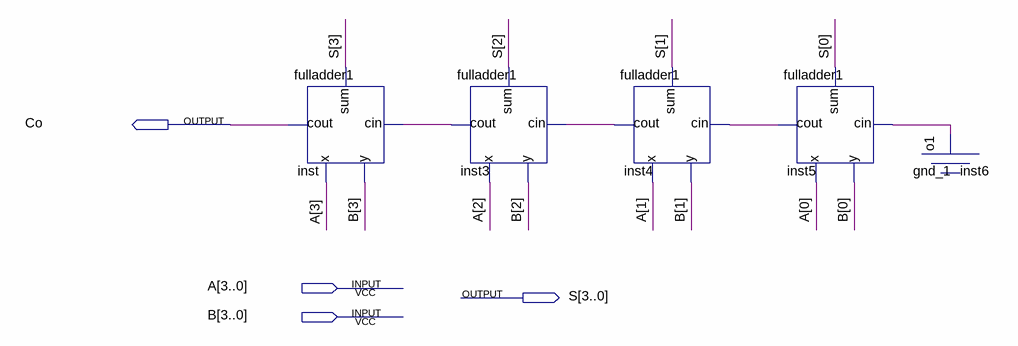
[diagram p0: schematic sheet]
// Quartus schematic FA4.bdf as structural Verilog: 5 symbols, 4 pins
module FA4 (
  input  [3:0] A,
  input  [3:0] B,
  output Co,
  output [3:0] S
);

  wire inst3_cout, inst4_cout, inst5_cout, inst6_o1;

  fulladder1 inst (.x(A[3]), .y(B[3]), .cin(inst3_cout), .sum(S[3]), .cout(Co));
  fulladder1 inst3 (.x(A[2]), .y(B[2]), .cin(inst4_cout), .sum(S[2]), .cout(inst3_cout));
  fulladder1 inst4 (.x(A[1]), .y(B[1]), .cin(inst5_cout), .sum(S[1]), .cout(inst4_cout));
  fulladder1 inst5 (.x(A[0]), .y(B[0]), .cin(inst6_o1), .sum(S[0]), .cout(inst5_cout));
  gnd_1 inst6 (.o1(inst6_o1));
endmodule
